# Altium schematic sheet FPGA_VCC.SchDoc: DmPro15 Vector FPGA VCC
size A4
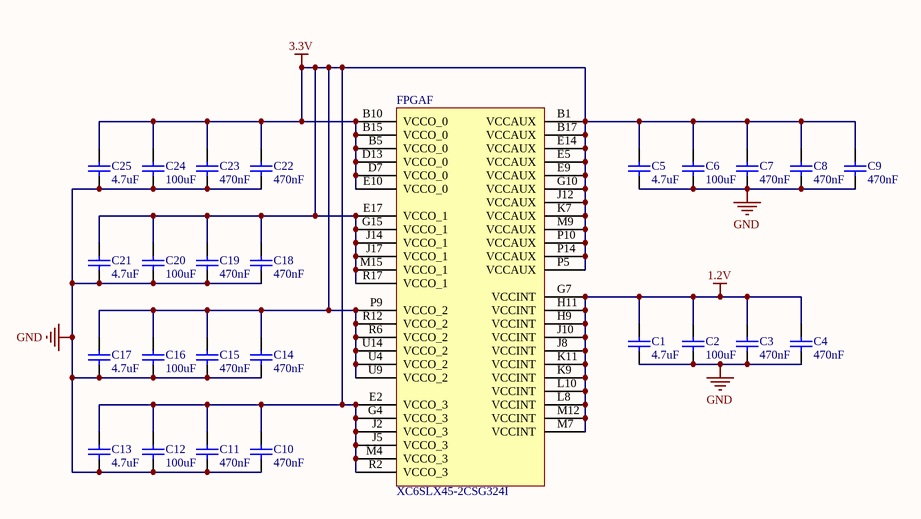
[diagram p0: FPGA_VCC.SchDoc]

## Parts
C1  4.7uF  [CAPC0603(1608)100_M]
C2  100uF  [CAPC0805(2012)75_L]
C3  470nF  [CAPC0603(1608)100_M]
C4  470nF  [CAPC0603(1608)100_M]
C5  4.7uF  [CAPC0603(1608)100_M]
C6  100uF  [CAPC0805(2012)75_L]
C7  470nF  [CAPC0603(1608)100_M]
C8  470nF  [CAPC0603(1608)100_M]
C9  470nF  [CAPC0603(1608)100_M]
C10  470nF  [CAPC0603(1608)100_M]
C11  470nF  [CAPC0603(1608)100_M]
C12  100uF  [CAPC0805(2012)75_L]
C13  4.7uF  [CAPC0603(1608)100_M]
C14  470nF  [CAPC0603(1608)100_M]
C15  470nF  [CAPC0603(1608)100_M]
C16  100uF  [CAPC0805(2012)75_L]
C17  4.7uF  [CAPC0603(1608)100_M]
C18  470nF  [CAPC0603(1608)100_M]
C19  470nF  [CAPC0603(1608)100_M]
C20  100uF  [CAPC0805(2012)75_L]
C21  4.7uF  [CAPC0603(1608)100_M]
C22  470nF  [CAPC0603(1608)100_M]
C23  470nF  [CAPC0603(1608)100_M]
C24  100uF  [CAPC0805(2012)75_L]
C25  4.7uF  [CAPC0603(1608)100_M]
FPGA  XC6SLX45-2CSG324I  [CSG324]  (part F of 8)

## Nets
1.2V: C1.2 C2.2 C3.2 C4.2 FPGA.G7(VCCINT) FPGA.H9(VCCINT) FPGA.H11(VCCINT) FPGA.J8(VCCINT) FPGA.J10(VCCINT) FPGA.K9(VCCINT) FPGA.K11(VCCINT) FPGA.L8(VCCINT) FPGA.L10(VCCINT) FPGA.M7(VCCINT) FPGA.M12(VCCINT)
3.3V: C5.2 C6.2 C7.2 C8.2 C9.2 C10.2 C11.2 C12.2 C13.2 C14.2 C15.2 C16.2 C17.2 C18.2 C19.2 C20.2 C21.2 C22.2 C23.2 C24.2 C25.2 FPGA.B1(VCCAUX) FPGA.B5(VCCO_0) FPGA.B10(VCCO_0) FPGA.B15(VCCO_0) FPGA.B17(VCCAUX) FPGA.D7(VCCO_0) FPGA.D13(VCCO_0) FPGA.E2(VCCO_3) FPGA.E5(VCCAUX) FPGA.E9(VCCAUX) FPGA.E10(VCCO_0) FPGA.E14(VCCAUX) FPGA.E17(VCCO_1) FPGA.G4(VCCO_3) FPGA.G10(VCCAUX) FPGA.G15(VCCO_1) FPGA.J2(VCCO_3) FPGA.J5(VCCO_3) FPGA.J12(VCCAUX) FPGA.J14(VCCO_1) FPGA.J17(VCCO_1) FPGA.K7(VCCAUX) FPGA.M4(VCCO_3) FPGA.M9(VCCAUX) FPGA.M15(VCCO_1) FPGA.P5(VCCAUX) FPGA.P9(VCCO_2) FPGA.P10(VCCAUX) FPGA.P14(VCCAUX) FPGA.R2(VCCO_3) FPGA.R6(VCCO_2) FPGA.R12(VCCO_2) FPGA.R17(VCCO_1) FPGA.U4(VCCO_2) FPGA.U9(VCCO_2) FPGA.U14(VCCO_2)
GND: C1.1 C2.1 C3.1 C4.1 C5.1 C6.1 C7.1 C8.1 C9.1 C10.1 C11.1 C12.1 C13.1 C14.1 C15.1 C16.1 C17.1 C18.1 C19.1 C20.1 C21.1 C22.1 C23.1 C24.1 C25.1

## Notes on the sheet
- Title
- Size:
- Date:
- A4
- Number:
- Time:
- Revision:
- Sheet
- of
- File:

## Library data of the parts
C1 C3-C5 C7-C11 C13-C15 C17-C19 C21-C23 C25 = CMP-1035-00001-1: CAP 0.5pF 10V Â±0.1pF 0603 (1608 Metric) Thickness 1mm SMD; Case-EIA: 0603; Case-Metric: 1608; Max Thickness: 1 mm; Tolerance: Â±0.1pF; Technology: SMT; Rated Voltage: 10 V
  C1 C5 C13 C17 C21 C25: Value: 4.7uF
  C3 C4 C7-C11 C14 C15 C18 C19 C22 C23: Value: 470nF
C2 C6 C12 C16 C20 C24 = CMP-1036-00001-1: CAP 0.5pF 10V Â±0.1pF 0805 (2012 Metric) Thickness 0.75mm SMD; Case-Metric: 2012; Case-EIA: 0805; Tolerance: Â±0.1pF; Max Thickness: 0.75 mm; Technology: SMT; Rated Voltage: 10 V; Value: 100uF
FPGA = XC6SLX45-2CSG324I: Spartan-6 LX 1.2V FPGA, 218 User I/Os, 324-Ball Chip-Scale BGA (0.8mm Pitch), Speed Grade 2, Industrial Grade, Pb-Free; DatasheetVersion: ver1.6, Nov-2010; PackageVersion: ver1.1, Nov-2009; PackageReference: CSG324; PackageDescription: 324-Ball Chip-Scale BGA (CSG324) Package, 0.8 mm Pitch; Code_JEDEC: MO-275-KKAC-1; ComponentLink1Description: Manufacturer URL; ComponentLink1URL: http://www.xilinx.com/; ComponentLink2Description: Spartan-6 Datasheet; ComponentLink2URL: http://www.xilinx.com/support/documentation/data_sheets/ds160.pdf; ComponentLink3Description: Spartan-6 Documents; ComponentLink3URL: http://www.xilinx.com/support/documentation/spartan-6.htm